# EAGLE design untitled (EAGLE 9.5.1)
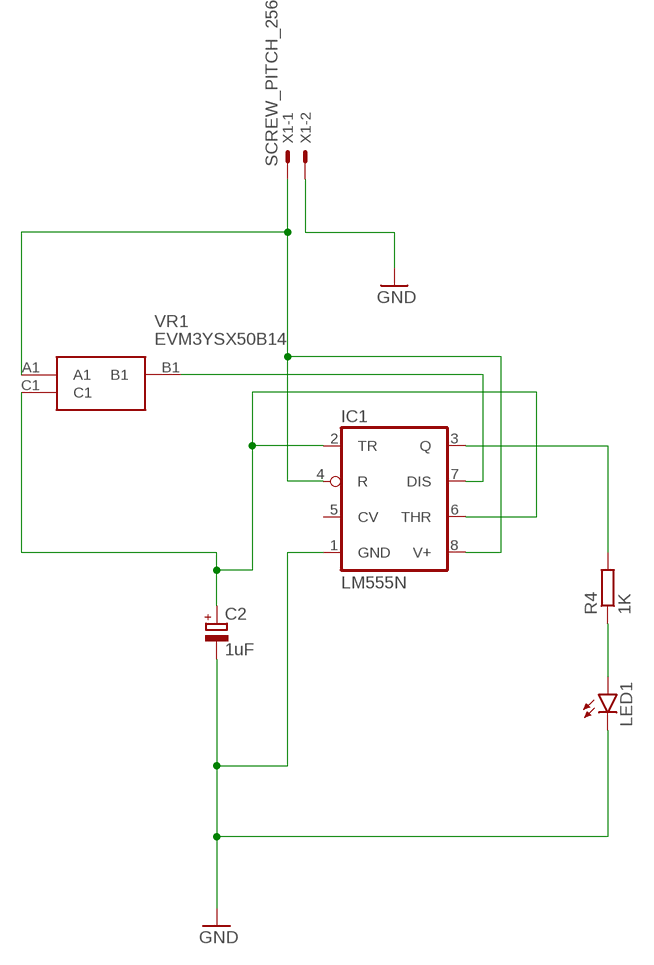
[diagram p0: schematic, sheet 1]

## Parts
C2  1uF  CPOL-EUE2-5  [E2-5]
IC1  LM555N  [DIL08]
LED1  LED_1206SMT1206  [1206]
R4  1K  CARBON/METAL_FILM_RESISTOR0207/10  [0207/10]
VR1  EVM3YSX50B14  [EVM3YSX50B14]
X1  SCREW_PITCH_256  [22-23-2021]

## Nets
GND: C2.- IC1.1(GND) LED1.C X1.2
N$1: C2.+ IC1.2(TR) IC1.6(THR) VR1.C1
N$2: LED1.A R4.1
N$3: IC1.7(DIS) VR1.B1
N$4: IC1.4(R) IC1.8(V+) VR1.A1 X1.1
N$6: IC1.3(Q) R4.2
Unconnected: IC1.5(CV)

## Library data of the parts
C2 = rcl:CPOL-EU: POLARIZED CAPACITOR, European symbol; SPICEPREFIX: C
IC1 = linear:*555: TIMER
LED1 = CommonParts:LED_1206: LED OSRAM: - CHIPLED LG R971, LG N971, LY N971, LG Q971, LY Q971, LO R971, LY R971 LH N974, LH R974 LS Q976, LO Q976, LY Q976 LO Q996 - Hyper CHIPLED LW Q18S LB Q993, LB Q99A, LB R99A - SideLED LS A670, LO A670, LY A670, LG A670, LP A670 LB A673, LV A673, LT A673, LW A673 LH A674 LY A675 LS A676, LA A676, LO A676, LY A676, LW A676 LS A679, LY A679, LG A679 - Hyper Micro SIDELED® LS Y876, LA Y876, LO Y876, LY Y876 LT Y87S - SmartLED LW L88C, LW L88S LB L89C, LB L89S, LG L890 LS L89K, LO L89K, LY L89K LS L896, LA L896, LO L896, LY L896 - TOPLED LS T670, LO T670, LY T670, LG T670, LP T670 LSG T670, LSP T670, LSY T670, LOP T670, LYG T670 LG T671, LOG T671, LSG T671 LB T673, LV T673, LT T673, LW T673 LH T674 LS T676, LA T676, LO T676, LY T676, LB T676, LH T676, LSB T676, LW T676 LB T67C, LV T67C, LT T67C, LS T67K, LO T67K, LY T67K, LW E67C LS E67B, LA E67B, LO E67B, LY E67B, LB E67C, LV E67C, LT E67C LW T67C LS T679, LY T679, LG T679 LS T770, LO T770, LY T770, LG T770, LP T770 LB T773, LV T773, LT T773, LW T773 LH T774 LS E675, LA E675, LY E675, LS T675 LS T776, LA T776, LO T776, LY T776, LB T776 LHGB T686 LT T68C, LB T68C - Hyper Mini TOPLED® LB M676 - Mini TOPLED Santana® LG M470 LS M47K, LO M47K, LY M47K Source: http://www.osram.convergy.de LUXEON: - LUMILED® LXK2-PW12-R00, LXK2-PW12-S00, LXK2-PW14-U00, LXK2-PW14-V00 LXK2-PM12-R00, LXK2-PM12-S00, LXK2-PM14-U00 LXK2-PE12-Q00, LXK2-PE12-R00, LXK2-PE12-S00, LXK2-PE14-T00, LXK2-PE14-U00 LXK2-PB12-K00, LXK2-PB12-L00, LXK2-PB12-M00, LXK2-PB14-N00, LXK2-PB14-P00, LXK2-PB14-Q00 LXK2-PR12-L00, LXK2-PR12-M00, LXK2-PR14-Q00, LXK2-PR14-R00 LXK2-PD12-Q00, LXK2-PD12-R00, LXK2-PD12-S00 LXK2-PH12-R00, LXK2-PH12-S00 LXK2-PL12-P00, LXK2-PL12-Q00, LXK2-PL12-R00 Source: www.luxeon.com KINGBRIGHT: KA-3528ASYC Source: www.kingbright.com
R4 = CommonParts:CARBON/METAL_FILM_RESISTOR: RESISTOR, European symbol; SPICEPREFIX: R
VR1 = CommonParts:EVM3YSX50B14: SMD Cermet Trimmer Pot, 3mm Sq, 10K Source: Datasheet; DESCRIPTION: SMD Cermet Trimmer Pot, 3mm Sq, 10K; HEIGHT: 1.55mm; MANUFACTURER_NAME: Panasonic; MANUFACTURER_PART_NUMBER: EVM3YSX50B14
X1 = CommonParts:SCREW_PITCH_256: .100" (2.54mm) Center Header - 2 Pin; MF: MOLEX; MPN: 22-23-2021; OC_FARNELL: 1462926; OC_NEWARK: 25C3832

## Board
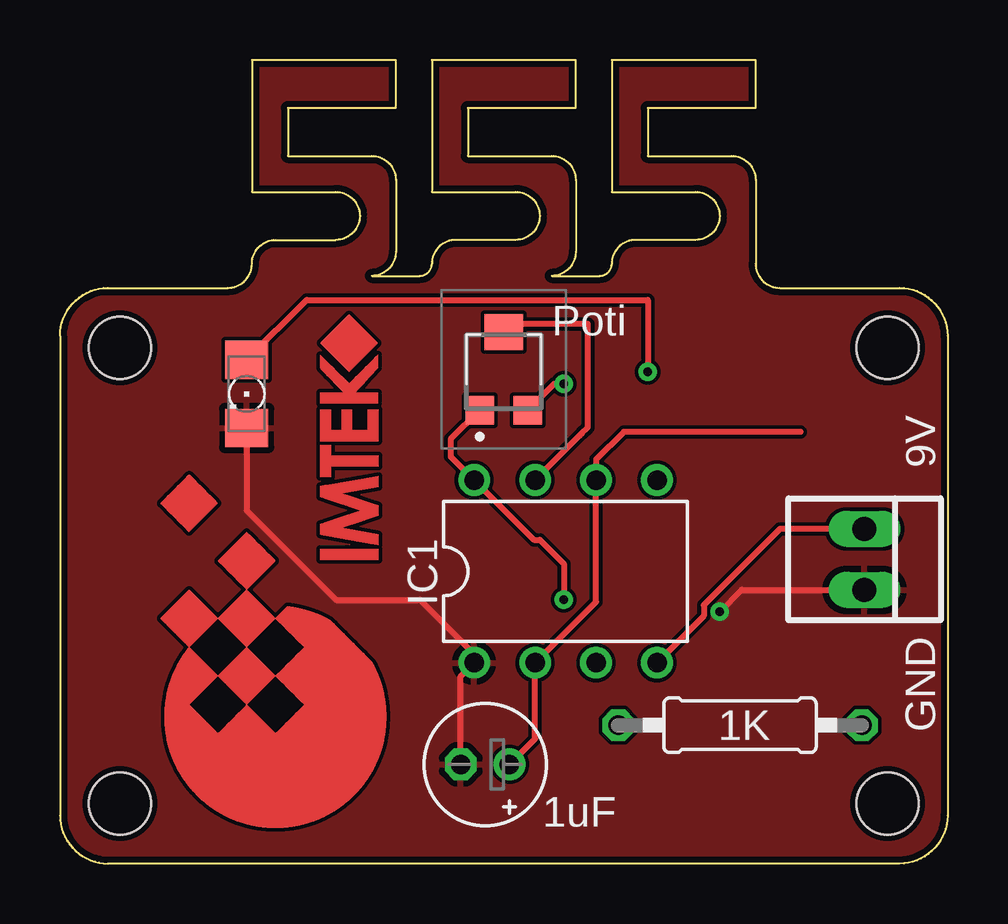
[diagram p1: board, top side]
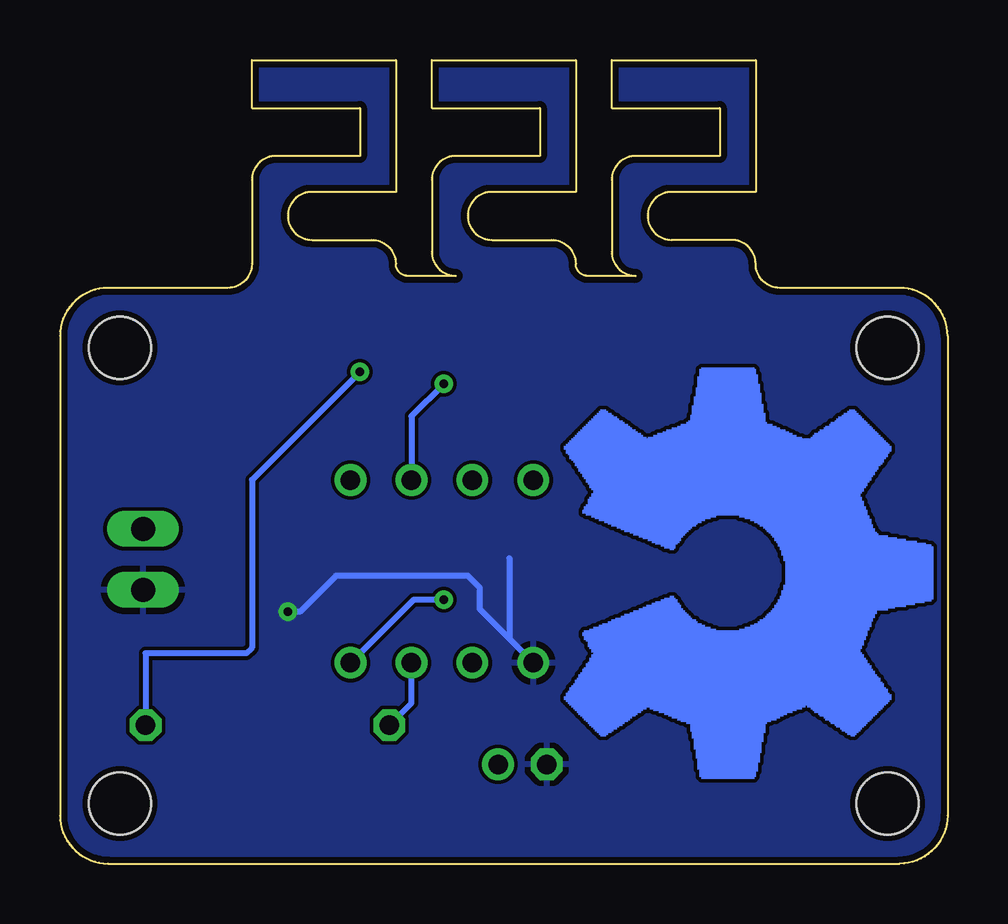
[diagram p2: board, bottom side, seen from below]

Size 37 x 33.5 mm. Coordinates in mm from the lower left corner, seen from the top.
Outline: 0,22 0,2 arc90 2,0 35,0 arc90 37,2 37,22 arc90 35,24 30,24 arc-90 29,25 29,28.5 arc90 28,29.5 24.5,29.5 24.5,31.5 29,31.5 29,33.5 23,33.5 23,28 26.5,28 arc-90 27.5,27 arc-90 26.5,26 24,26 arc90 23,25 arc-90 22.5,24.5 20.5,24.5 arc90 21.5,25.5 21.5,28.5 arc90 20.5,29.5 17,29.5 17,31.5 21.5,31.5 21.5,33.5 15.5,33.5 15.5,28 19,28 arc-90 20,27 arc-90 19,26 16.5,26 arc90 15.5,25 arc-90 15,24.5 13,24.5 arc90 14,25.5 14,28.5 arc90 13,29.5 9.5,29.5 9.5,31.5 14,31.5 14,33.5 8,33.5 8,28 11.5,28 arc-90 12.5,27 arc-90 11.5,26 9,26 arc90 8,25 arc-90 7,24 2,24 arc90 0,22
Copper layers (1*16): Top 0.035mm / dielectric 1.5mm / Bottom 0.035mm
Design rules "default *": minimum track width 6mil, minimum drill 0.35mm, track to track 6mil, track to pad 6mil, pad to pad 6mil, via to via 6mil, smd to smd 6mil, copper to edge 10mil, drill to drill 6mil, minimum pad ring 10mil, minimum via ring 8mil, stop-mask expansion 4mil, vias tented up to drill 0mil, thermal gap 10mil
Holes 2.6 mm at 34.5,2.5 34.5,21.5 2.5,21.5 2.5,2.5

### Footprints (pad centres in the part's own frame; a part is rotated, then mirrored left to right if it is on the bottom)
E2-5 = drill 0.813 pad 1.27: + -1.016,0 | drill 0.813 pad 1.27 octagon: - 1.016,0
DIL08 = drill 0.813 pad 1.27: 1 -3.81,-3.81; 2 -1.27,-3.81; 3 1.27,-3.81; 4 3.81,-3.81; 5 3.81,3.81; 6 1.27,3.81; 7 -1.27,3.81; 8 -3.81,3.81
1206 = smd 1.6 x 1.803: A -1.422,0; C 1.422,0
0207/10 = drill 0.813 octagon: 1 -5.08,0; 2 5.08,0
EVM3YSX50B14 = smd 1.2 x 1.2: A1 -1,-1.6; C1 1,-1.6 | smd 1.6 x 1.5: B1 0,1.65
22-23-2021 = drill 1 long: 1 -1.27,0; 2 1.27,0

### Placement (x,y rotation side)
C2  17.72,4.13 180 top
IC1  21.08,12.18 0 top
LED1  7.79,19.58 270 top
R4  28.35,5.77 180 top
VR1  18.5,20.5 0 top
X1  33.54,12.68 270 top

### Tracks (layer width: path | path; a pad name or v marks a point on that pad's centre or on a via)
GND  (via drill 0.35)
  Top 0.254: C2.- 16.71,7.81 IC1.1 17.27,8.73 15,11 11.5,11 7.79,14.71 LED1.C | v27.5,10.5 28.41,11.41 X1.2
  Bottom 0.254: 18.27,12.73 18.27,9.37 IC1.1 19.5,10.6 19.5,11.5 20,12 25.5,12 27,10.5 v27.5,10.5
  pour Top: 0,0 0,34 38,34 38,0
  pour Bottom: 0,34 38,34 38,0 0,0
N$1  (via drill 0.35)
  Top 0.254: 30.87,18 23.5,18 22.35,16.85 IC1.6 22.35,10.91 IC1.2 19.81,5.2 C2.+ | VR1.C1 20.6,20 v21,20
  Bottom 0.254: v21,20 22.35,18.65 IC1.6
N$2  (via drill 0.35)
  Top 0.254: LED1.A 10.29,23.5 24.5,23.5 v24.5,20.5
  Bottom 0.254: R4.1 33.43,8.77 29.23,8.77 29,9 29,16 v24.5,20.5
N$3
  Top 0.254: IC1.7 21.66,17.84 21.75,17.93 22,18.18 22,22.5 18.85,22.5 VR1.B1
N$4  (via drill 0.35)
  Top 0.254: v21,11 21,12.5 20,13.5 19.76,13.5 IC1.8 16.29,16.97 16.29,17.69 VR1.A1 | IC1.4 26.84,10.32 26.84,10.77 30.02,13.95 X1.1
  Bottom 0.254: v21,11 22.26,11 IC1.4
N$6
  Bottom 0.254: R4.2 22.35,6.69 IC1.3
(copper drawn outside any net)
  shapes: Bottom area x369, Top area x4521

### Text on the board
tNames: Poti | 9V | GND